# Altium schematic sheet Receptor1.SchDoc
size A3
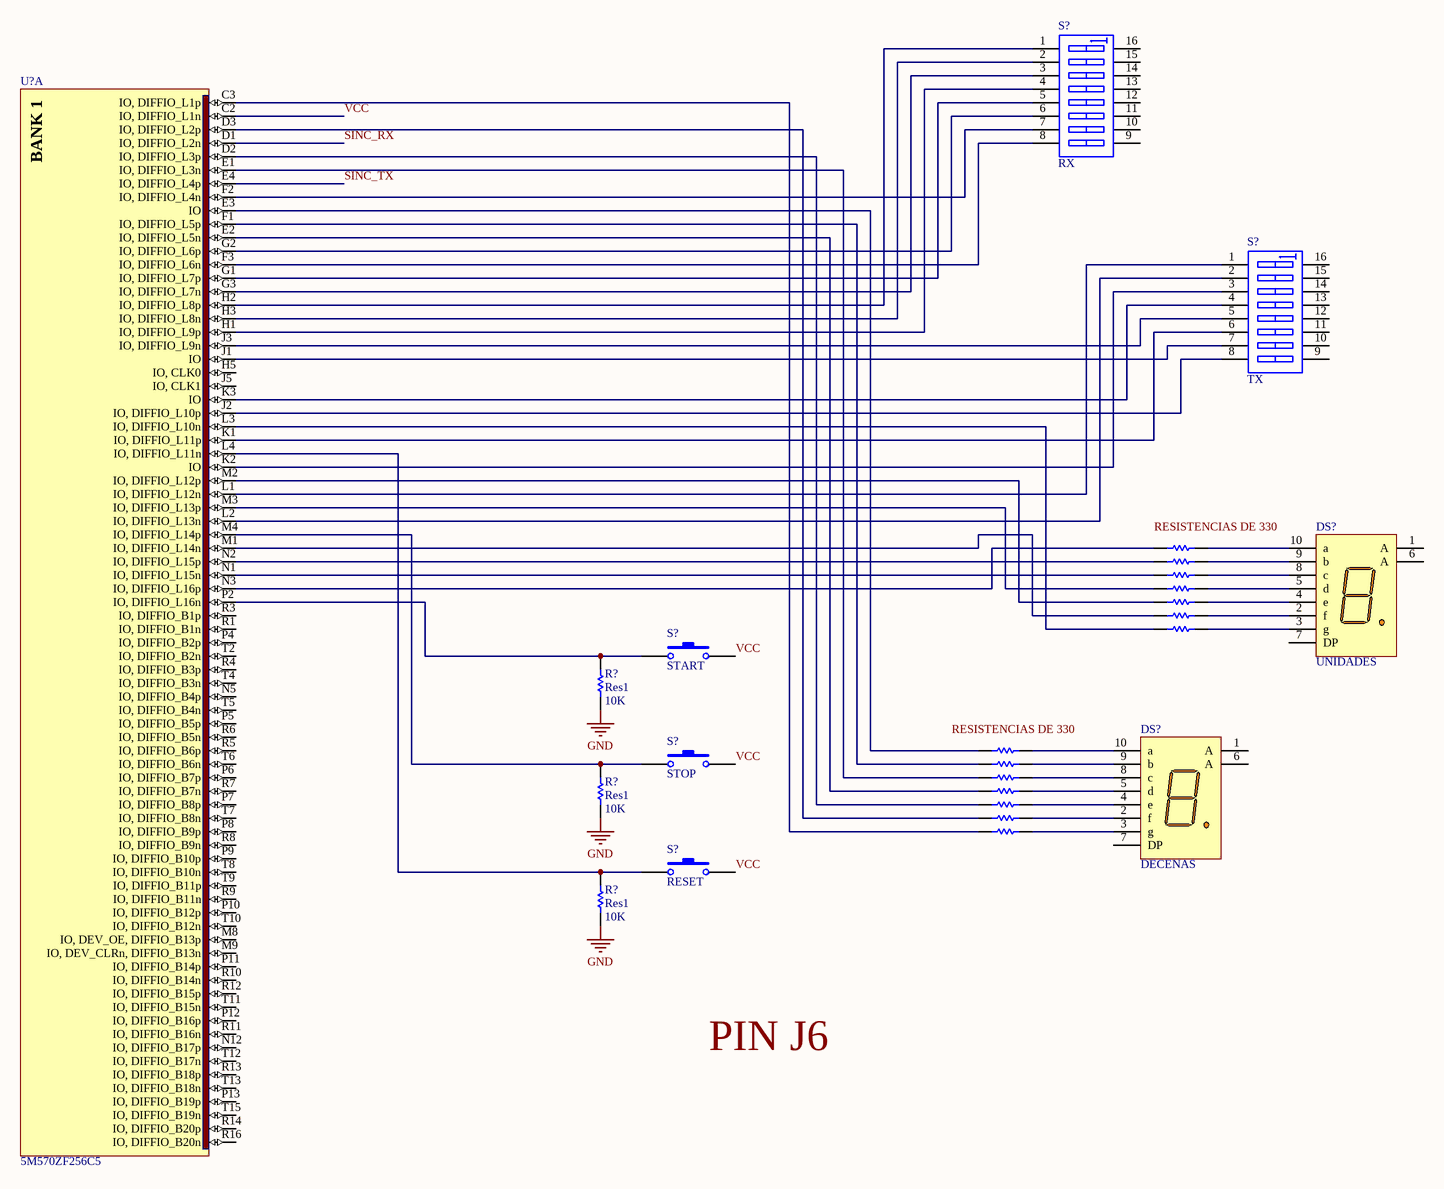
[diagram p0: Receptor1.SchDoc]

## Parts
(Parts that share a designator on the sheet are numbered #1, #2 ... from top to bottom, then left to right.)
?#1  (no value)  [AXIAL-0.3]
?#2  (no value)  [AXIAL-0.3]
?#3  (no value)  [AXIAL-0.3]
?#4  (no value)  [AXIAL-0.3]
?#5  (no value)  [AXIAL-0.3]
?#6  (no value)  [AXIAL-0.3]
?#7  (no value)  [AXIAL-0.3]
?#8  (no value)  [AXIAL-0.3]
?#9  (no value)  [AXIAL-0.3]
?#10  (no value)  [AXIAL-0.3]
?#11  (no value)  [AXIAL-0.3]
?#12  (no value)  [AXIAL-0.3]
?#13  (no value)  [AXIAL-0.3]
?#14  (no value)  [AXIAL-0.3]
DS?#1  UNIDADES  [A]
DS?#2  DECENAS  [A]
R?#1  Res1  value 10K  [AXIAL-0.3]
R?#2  Res1  value 10K  [AXIAL-0.3]
R?#3  Res1  value 10K  [AXIAL-0.3]
S?#1  RX  [DIP_SW_8WAY_SMD]
S?#2  TX  [DIP_SW_8WAY_SMD]
S?#3  START  [SPST-2]
S?#4  STOP  [SPST-2]
S?#5  RESET  [SPST-2]
U?  5M570ZF256C5  [FBGA256_A-155]  (part A of 5)

## Nets
GND: R?#1.1 R?#2.1 R?#3.1
SINC_RX: U?.D1(IO,_DIFFIO_L2n)
SINC_TX: U?.E4(IO,_DIFFIO_L4p)
VCC: S?#3.2 S?#4.2 S?#5.2 U?.C2(IO,_DIFFIO_L1n)
Net?#1_1: ?#1.1 U?.N3(IO,_DIFFIO_L16p)
Net?#1_2: ?#1.2 DS?#1.10(a)
Net?#2_1: ?#2.1 U?.N2(IO,_DIFFIO_L15p)
Net?#2_2: ?#2.2 DS?#1.9(b)
Net?#3_1: ?#3.1 U?.N1(IO,_DIFFIO_L15n)
Net?#3_2: ?#3.2 DS?#1.8(c)
Net?#4_1: ?#4.1 U?.M3(IO,_DIFFIO_L13p)
Net?#4_2: ?#4.2 DS?#1.5(d)
Net?#5_1: ?#5.1 U?.M2(IO,_DIFFIO_L12p)
Net?#5_2: ?#5.2 DS?#1.4(e)
Net?#6_1: ?#6.1 U?.M1(IO,_DIFFIO_L14n)
Net?#6_2: ?#6.2 DS?#1.2(f)
Net?#7_1: ?#7.1 U?.L3(IO,_DIFFIO_L10n)
Net?#7_2: ?#7.2 DS?#1.3(g)
Net?#8_1: ?#8.1 U?.E3(IO)
Net?#8_2: ?#8.2 DS?#2.10(a)
Net?#9_1: ?#9.1 U?.F1(IO,_DIFFIO_L5p)
Net?#9_2: ?#9.2 DS?#2.9(b)
Net?#10_1: ?#10.1 U?.E1(IO,_DIFFIO_L3n)
Net?#10_2: ?#10.2 DS?#2.8(c)
Net?#11_1: ?#11.1 U?.E2(IO,_DIFFIO_L5n)
Net?#11_2: ?#11.2 DS?#2.5(d)
Net?#12_1: ?#12.1 U?.D2(IO,_DIFFIO_L3p)
Net?#12_2: ?#12.2 DS?#2.4(e)
Net?#13_1: ?#13.1 U?.D3(IO,_DIFFIO_L2p)
Net?#13_2: ?#13.2 DS?#2.2(f)
Net?#14_1: ?#14.1 U?.C3(IO,_DIFFIO_L1p)
Net?#14_2: ?#14.2 DS?#2.3(g)
NetR?#1_2: R?#1.2 S?#3.1 U?.P2(IO,_DIFFIO_L16n)
NetR?#2_2: R?#2.2 S?#4.1 U?.M4(IO,_DIFFIO_L14p)
NetR?#3_2: R?#3.2 S?#5.1 U?.L4(IO,_DIFFIO_L11n)
NetS?#1_1: S?#1.1(A1) U?.H2(IO,_DIFFIO_L8p)
NetS?#1_2: S?#1.2(A2) U?.H3(IO,_DIFFIO_L8n)
NetS?#1_3: S?#1.3(A3) U?.G3(IO,_DIFFIO_L7n)
NetS?#1_4: S?#1.4(A4) U?.H1(IO,_DIFFIO_L9p)
NetS?#1_5: S?#1.5(A5) U?.G1(IO,_DIFFIO_L7p)
NetS?#1_6: S?#1.6(A6) U?.G2(IO,_DIFFIO_L6p)
NetS?#1_7: S?#1.7(A7) U?.F2(IO,_DIFFIO_L4n)
NetS?#1_8: S?#1.8(A8) U?.F3(IO,_DIFFIO_L6n)
NetS?#2_1: S?#2.1(A1) U?.L1(IO,_DIFFIO_L12n)
NetS?#2_2: S?#2.2(A2) U?.L2(IO,_DIFFIO_L13n)
NetS?#2_3: S?#2.3(A3) U?.K2(IO)
NetS?#2_4: S?#2.4(A4) U?.K3(IO)
NetS?#2_5: S?#2.5(A5) U?.J3(IO,_DIFFIO_L9n)
NetS?#2_6: S?#2.6(A6) U?.K1(IO,_DIFFIO_L11p)
NetS?#2_7: S?#2.7(A7) U?.J1(IO)
NetS?#2_8: S?#2.8(A8) U?.J2(IO,_DIFFIO_L10p)

Not connected (* = marked no-connect by the designer): DS?#1 1(A) 6(A) 7(DP); DS?#2 1(A) 6(A) 7(DP); S?#1 9(B8) 10(B7) 11(B6) 12(B5) 13(B4) 14(B3) 15(B2) 16(B1); S?#2 9(B8) 10(B7) 11(B6) 12(B5) 13(B4) 14(B3) 15(B2) 16(B1); U? H5(IO,_CLK0) J5(IO,_CLK1) M8(IO,_DEV_OE,_DIFFIO_B13p) M9(IO,_DEV_CLRn,_DIFFIO_B13n) N5(IO,_DIFFIO_B4p) N12(IO,_DIFFIO_B17p) P4(IO,_DIFFIO_B2p) P5(IO,_DIFFIO_B5p) P6(IO,_DIFFIO_B7p) P7(IO,_DIFFIO_B8p) P8(IO,_DIFFIO_B9p) P9(IO,_DIFFIO_B10p) P10(IO,_DIFFIO_B12p) P11(IO,_DIFFIO_B14p) P12(IO,_DIFFIO_B16p) P13(IO,_DIFFIO_B19p) R1(IO,_DIFFIO_B1n) R3(IO,_DIFFIO_B1p) R4(IO,_DIFFIO_B3p) R5(IO,_DIFFIO_B6p) R6(IO,_DIFFIO_B5n) R7(IO,_DIFFIO_B7n) R8(IO,_DIFFIO_B9n) R9(IO,_DIFFIO_B11n) R10(IO,_DIFFIO_B14n) R11(IO,_DIFFIO_B16n) R12(IO,_DIFFIO_B15p) R13(IO,_DIFFIO_B18p) R14(IO,_DIFFIO_B20p) R16(IO,_DIFFIO_B20n) T2(IO,_DIFFIO_B2n) T4(IO,_DIFFIO_B3n) T5(IO,_DIFFIO_B4n) T6(IO,_DIFFIO_B6n) T7(IO,_DIFFIO_B8n) T8(IO,_DIFFIO_B10n) T9(IO,_DIFFIO_B11p) T10(IO,_DIFFIO_B12n) T11(IO,_DIFFIO_B15n) T12(IO,_DIFFIO_B17n) T13(IO,_DIFFIO_B18n) T15(IO,_DIFFIO_B19n)

## Notes on the sheet
- Labels drawn without touching a wire or pin: PIN J6, RESISTENCIAS DE 330
- (in symbol 5M570ZF256C5, part A) BANK 1

## Library data of the parts
?#1-?#14 R?#1-R?#3 = Res1: Resistor; Published: 8-Jun-2000; LatestRevisionDate: 17-Jul-2002; LatestRevisionNote: Re-released for DXP Platform.; PackageReference: AXIAL-0.3; Publisher: Altium Limited; PackageDescription: Axial Device, Thru-Hole; 2 Leads; 0.3 in Pin Spacing
DS?#1 DS?#2 = Dpy Amber-CA: 7.62 mm Black Surface Orange 7-Segment Display: CA, RH DP; MinimumIntensity: 354 ucd; Note: IF = 5 mA; Note: Pins 1 and 6 are redundant Anodes.; Published: 8-Jun-2000; LatestRevisionDate: 17-Dec-2003; LatestRevisionNote: Schematic revised, PCB Footprint replaced.; DatasheetVersion: 19-Feb-2002; PackageVersion: 11-Feb-2002; PackageReference: A; Publisher: Altium Limited; PackageDescription: LED, 7-Segment Display, 7.62 mm, RHD; 10 Leads; Row Space 5.08 mm; Pitch 2.54 mm; Colour: Orange; ComponentLink1Description: Manufacturer Link; ComponentLink1URL: http://www.agilent.com/
S?#1 S?#2 = SW DIP-8: DIP Switch, 8 Position, SPST; Published: 24-Mar-1999; LatestRevisionDate: 17-Jul-2002; LatestRevisionNote: Re-released for DXP Platform.; PackageReference: DIP_SW_8WAY_SMD; Publisher: Altium Limited; PackageDescription: DIP Switch; 16 Leads
S?#3-S?#5 = SW-PB: Switch; Published: 24-Mar-1999; LatestRevisionDate: 17-Jul-2002; LatestRevisionNote: Re-released for DXP Platform.; PackageReference: SPST-2; Publisher: Altium Limited; PackageDescription: Switch; 2 Leads
U? = 5M570ZF256C5: MAX V 1.8V CPLD, 159 IOs, 570 Logic Elements, 256-Pin FBGA, Commercial Temperature, Speed Grade 5; DatasheetVersion: ver1.2, May-2011; PackageVersion: ver2.0, Nov-2011; PackageReference: FBGA256_A-155; PackageDescription: 256-Pin FineLine Ball-Grid Array (FBGA) - Thin - Wire Bond - A:1.55; Code_JEDEC: MO-192-DAF-1; ComponentLink1Description: Manufacturer URL; ComponentLink1URL: http://www.altera.com/; ComponentLink2Description: Datasheet; ComponentLink2URL: http://www.altera.com/literature/hb/max-v/max5_handbook.pdf; ComponentLink3Description: MAX V Device Pin-Out files; ComponentLink3URL: http://www.altera.com/literature/lit-dp.jsp?category=MAX%205&showspreadsheet=y; ComponentLink4Description: Package Specification; ComponentLink4URL: http://www.altera.com/devicepackaging/04R-00230_03.pdf